# EAGLE design Connector Board rev1 (EAGLE 9.6.2)

## Sheet 1 of 3
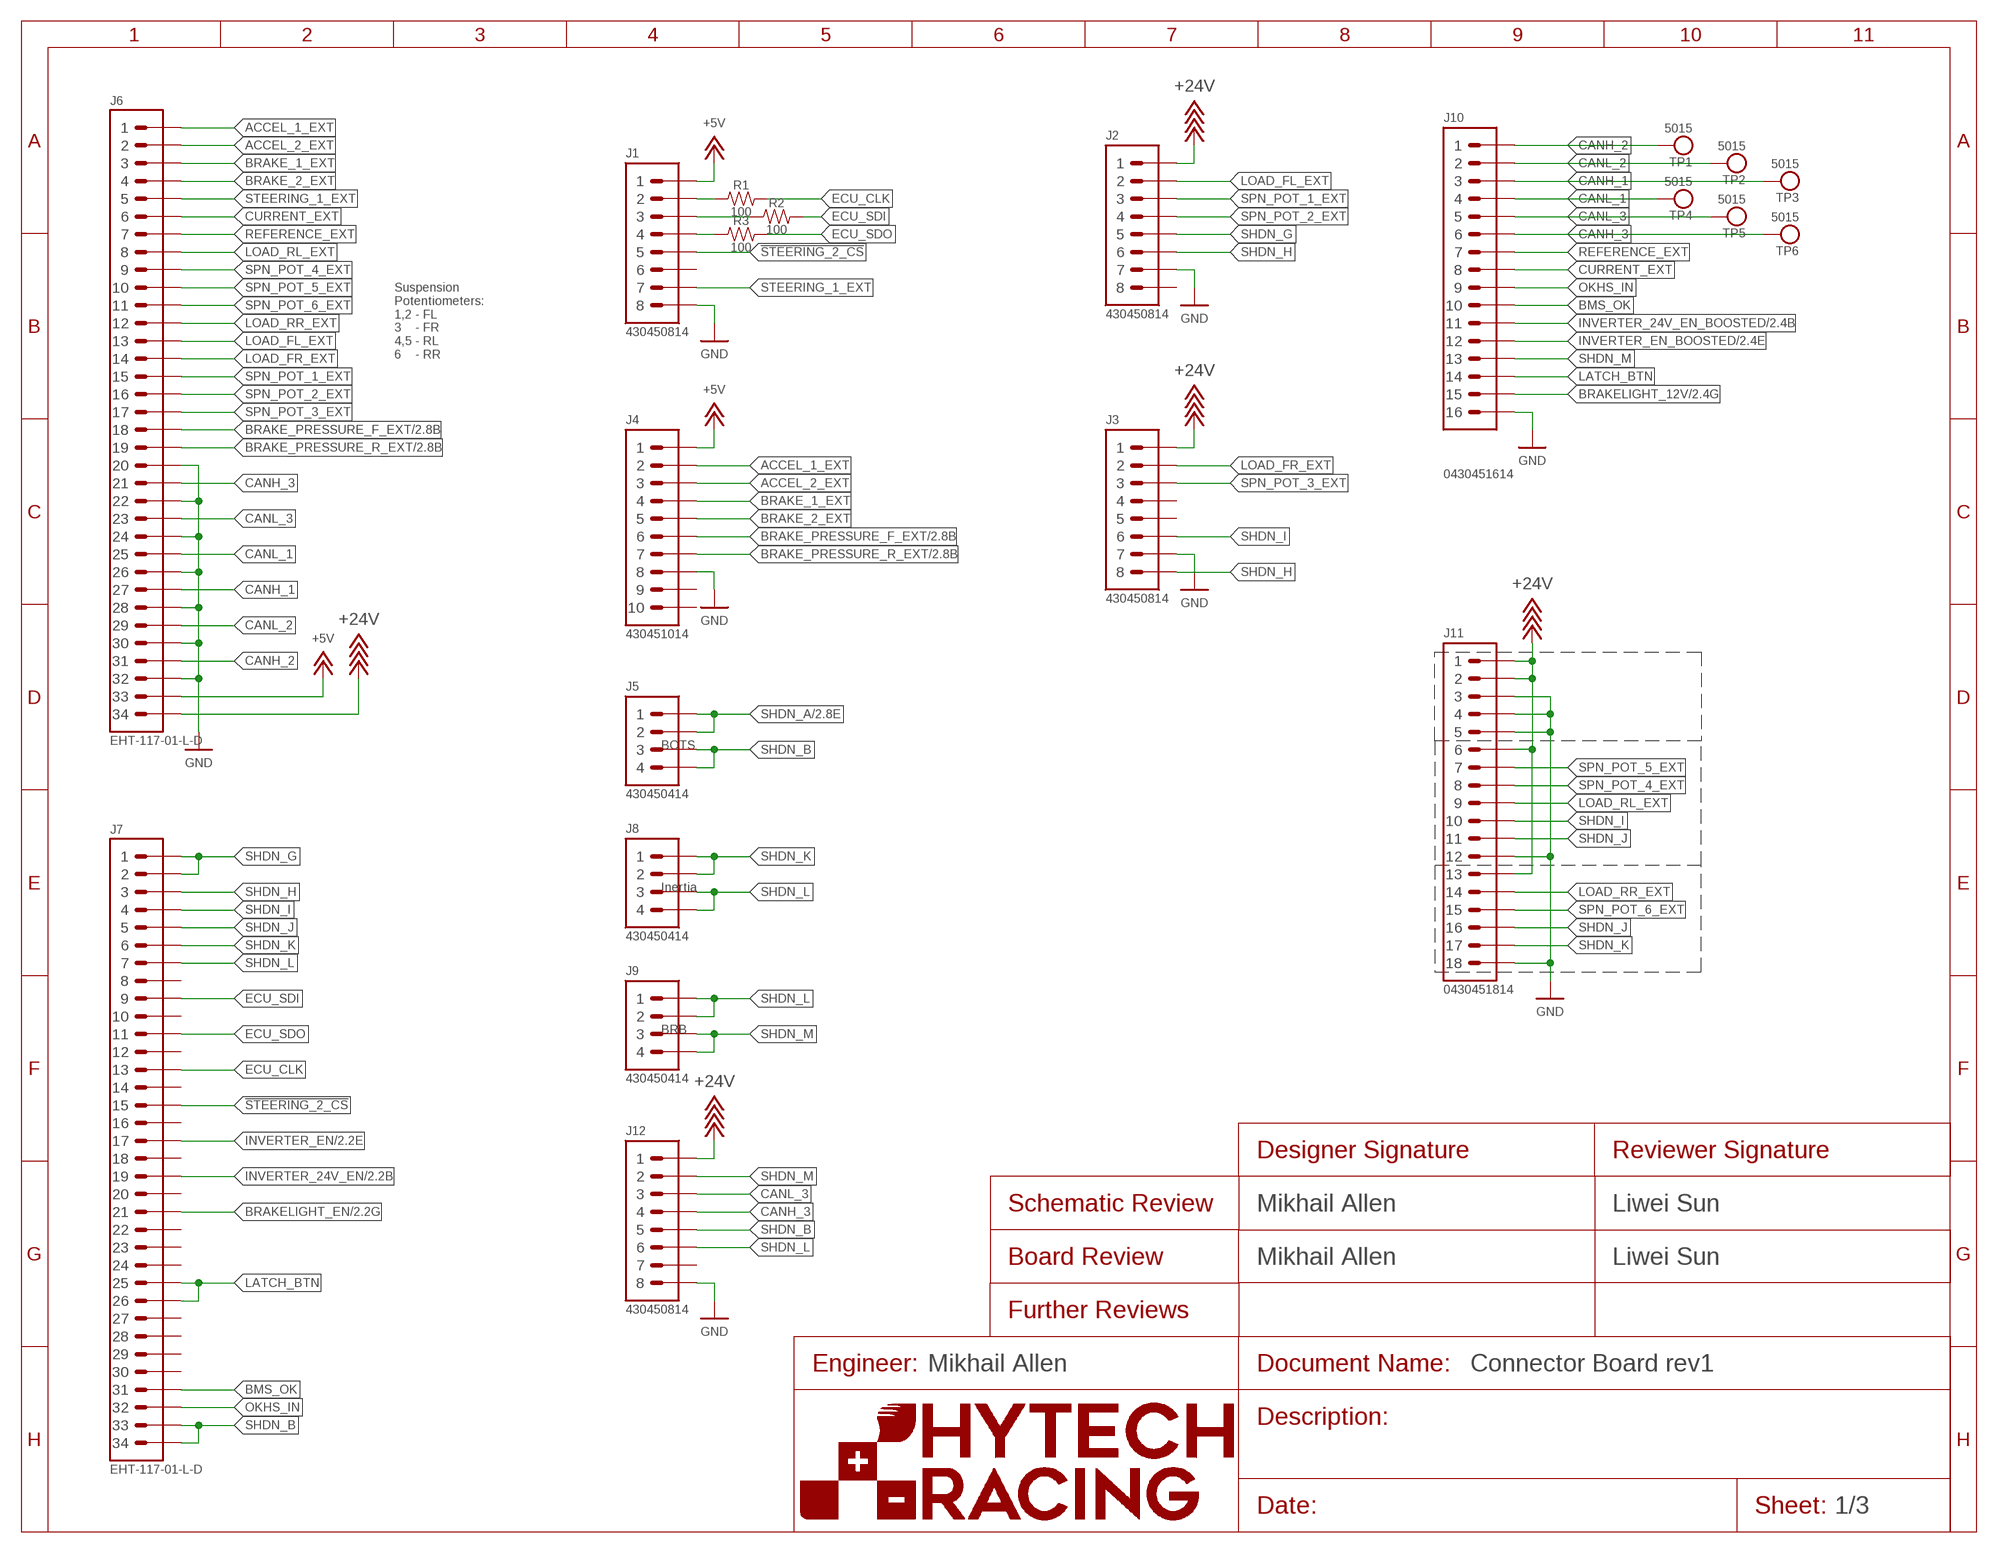
[diagram p0: schematic, sheet 1]
FRAME1 (FRAME): DESIGNER_BOARD: Mikhail Allen; DESIGNER_SCHEMATIC: Mikhail Allen; ENGINEER: Mikhail Allen; REVIEWER_BOARD: Liwei Sun; REVIEWER_SCHEMATIC: Liwei Sun

### Parts
J1  CONNECTOR-8_μF_T_V_BLACK  [MOLEX_MICROFIT_PTH_VERTICAL_08_DUAL]
J2  CONNECTOR-8_μF_T_V_BLACK  [MOLEX_MICROFIT_PTH_VERTICAL_08_DUAL]
J3  CONNECTOR-8_μF_T_V_BLACK  [MOLEX_MICROFIT_PTH_VERTICAL_08_DUAL]
J4  CONNECTOR-10_MF_T_V_  [MOLEX_MICROFIT_PTH_VERTICAL_10_DUAL]
J5  CONNECTOR-4_μF_T_V_BLACK  [MOLEX_MICROFIT_PTH_VERTICAL_04_DUAL]
J6  CONNECTOR-34__  [EHT-117-01]
J7  CONNECTOR-34__  [EHT-117-01]
J8  CONNECTOR-4_μF_T_V_BLACK  [MOLEX_MICROFIT_PTH_VERTICAL_04_DUAL]
J9  CONNECTOR-4_μF_T_V_BLACK  [MOLEX_MICROFIT_PTH_VERTICAL_04_DUAL]
J10  CONNECTOR-16_MF_T_V_  [MOLEX_MICROFIT_PTH_VERTICAL_16_DUAL]
J11  CONNECTOR-18_MF_T_V_  [MOLEX_MICROFIT_PTH_VERTICAL_18_DUAL]
J12  CONNECTOR-8_μF_T_V_BLACK  [MOLEX_MICROFIT_PTH_VERTICAL_08_DUAL]
R1  RESISTOR_0603_100  [0603-RES]
R2  RESISTOR_0603_100  [0603-RES]
R3  RESISTOR_0603_100  [0603-RES]
TP1  TEST_POINT  [5015]
TP2  TEST_POINT  [5015]
TP3  TEST_POINT  [5015]
TP4  TEST_POINT  [5015]
TP5  TEST_POINT  [5015]
TP6  TEST_POINT  [5015]

### Nets
!STEERING_2_CS: J1.5 J7.15
+5V: J1.1 J4.1 J6.33
+24V: J2.1 J3.1 J6.34 J11.1 J11.2 J11.6 J11.13 J12.1 ; also sheet 2
ACCEL_1_EXT: J4.2 J6.1
ACCEL_2_EXT: J4.3 J6.2
BMS_OK: J7.31 J10.10
BRAKE_1_EXT: J4.4 J6.3
BRAKE_2_EXT: J4.5 J6.4
BRAKE_PRESSURE_F_EXT: J4.6 J6.18 ; also sheet 2
BRAKE_PRESSURE_R_EXT: J4.7 J6.19 ; also sheet 2
BRAKELIGHT_12V: J10.15 ; also sheet 2
BRAKELIGHT_EN: J7.21 ; also sheet 2
CANH_1: J6.27 J10.3 TP3.1
CANH_2: J6.31 J10.1 TP1.1
CANH_3: J6.21 J10.6 J12.4 TP6.1
CANL_1: J6.25 J10.4 TP4.1
CANL_2: J6.29 J10.2 TP2.1
CANL_3: J6.23 J10.5 J12.3 TP5.1
CURRENT_EXT: J6.6 J10.8
ECU_CLK: J7.13 R1.2
ECU_SDI: J7.9 R2.2
ECU_SDO: J7.11 R3.2
GND: J1.8 J2.7 J3.7 J4.8 J6.20 J6.22 J6.24 J6.26 J6.28 J6.30 J6.32 J10.16 J11.3 J11.4 J11.5 J11.12 J11.18 J12.8 ; also sheet 2
INVERTER_24V_EN: J7.19 ; also sheet 2
INVERTER_24V_EN_BOOSTED: J10.11 ; also sheet 2
INVERTER_EN: J7.17 ; also sheet 2
INVERTER_EN_BOOSTED: J10.12 ; also sheet 2
LATCH_BTN: J7.25 J7.26 J10.14
LOAD_FL_EXT: J2.2 J6.13
LOAD_FR_EXT: J3.2 J6.14
LOAD_RL_EXT: J6.8 J11.9
LOAD_RR_EXT: J6.12 J11.14
N$1: J1.2 R1.1
N$2: J1.3 R2.1
N$3: J1.4 R3.1
OKHS_IN: J7.32 J10.9
REFERENCE_EXT: J6.7 J10.7
SHDN_A: J5.1 J5.2 ; also sheet 2
SHDN_B: J5.3 J5.4 J7.33 J7.34 J12.5
SHDN_G: J2.5 J7.1 J7.2
SHDN_H: J2.6 J3.8 J7.3
SHDN_I: J3.6 J7.4 J11.10
SHDN_J: J7.5 J11.11 J11.16
SHDN_K: J7.6 J8.1 J8.2 J11.17
SHDN_L: J7.7 J8.3 J8.4 J9.1 J9.2 J12.6
SHDN_M: J9.3 J9.4 J10.13 J12.2
SPN_POT_1_EXT: J2.3 J6.15
SPN_POT_2_EXT: J2.4 J6.16
SPN_POT_3_EXT: J3.3 J6.17
SPN_POT_4_EXT: J6.9 J11.8
SPN_POT_5_EXT: J6.10 J11.7
SPN_POT_6_EXT: J6.11 J11.15
STEERING_1_EXT: J1.7 J6.5
Unconnected: J1.6 J2.8 J3.4 J3.5 J4.9 J4.10 J7.8 J7.10 J7.12 J7.14 J7.16 J7.18 J7.20 J7.22 J7.23 J7.24 J7.27 J7.28 J7.29 J7.30 J12.7

### Notes on the sheet
- Suspension
  Potentiometers:
  1,2 - FL
  3    - FR
  4,5 - RL
  6    - RR
- BOTS
- Inertia
- BRB

## Sheet 2 of 3
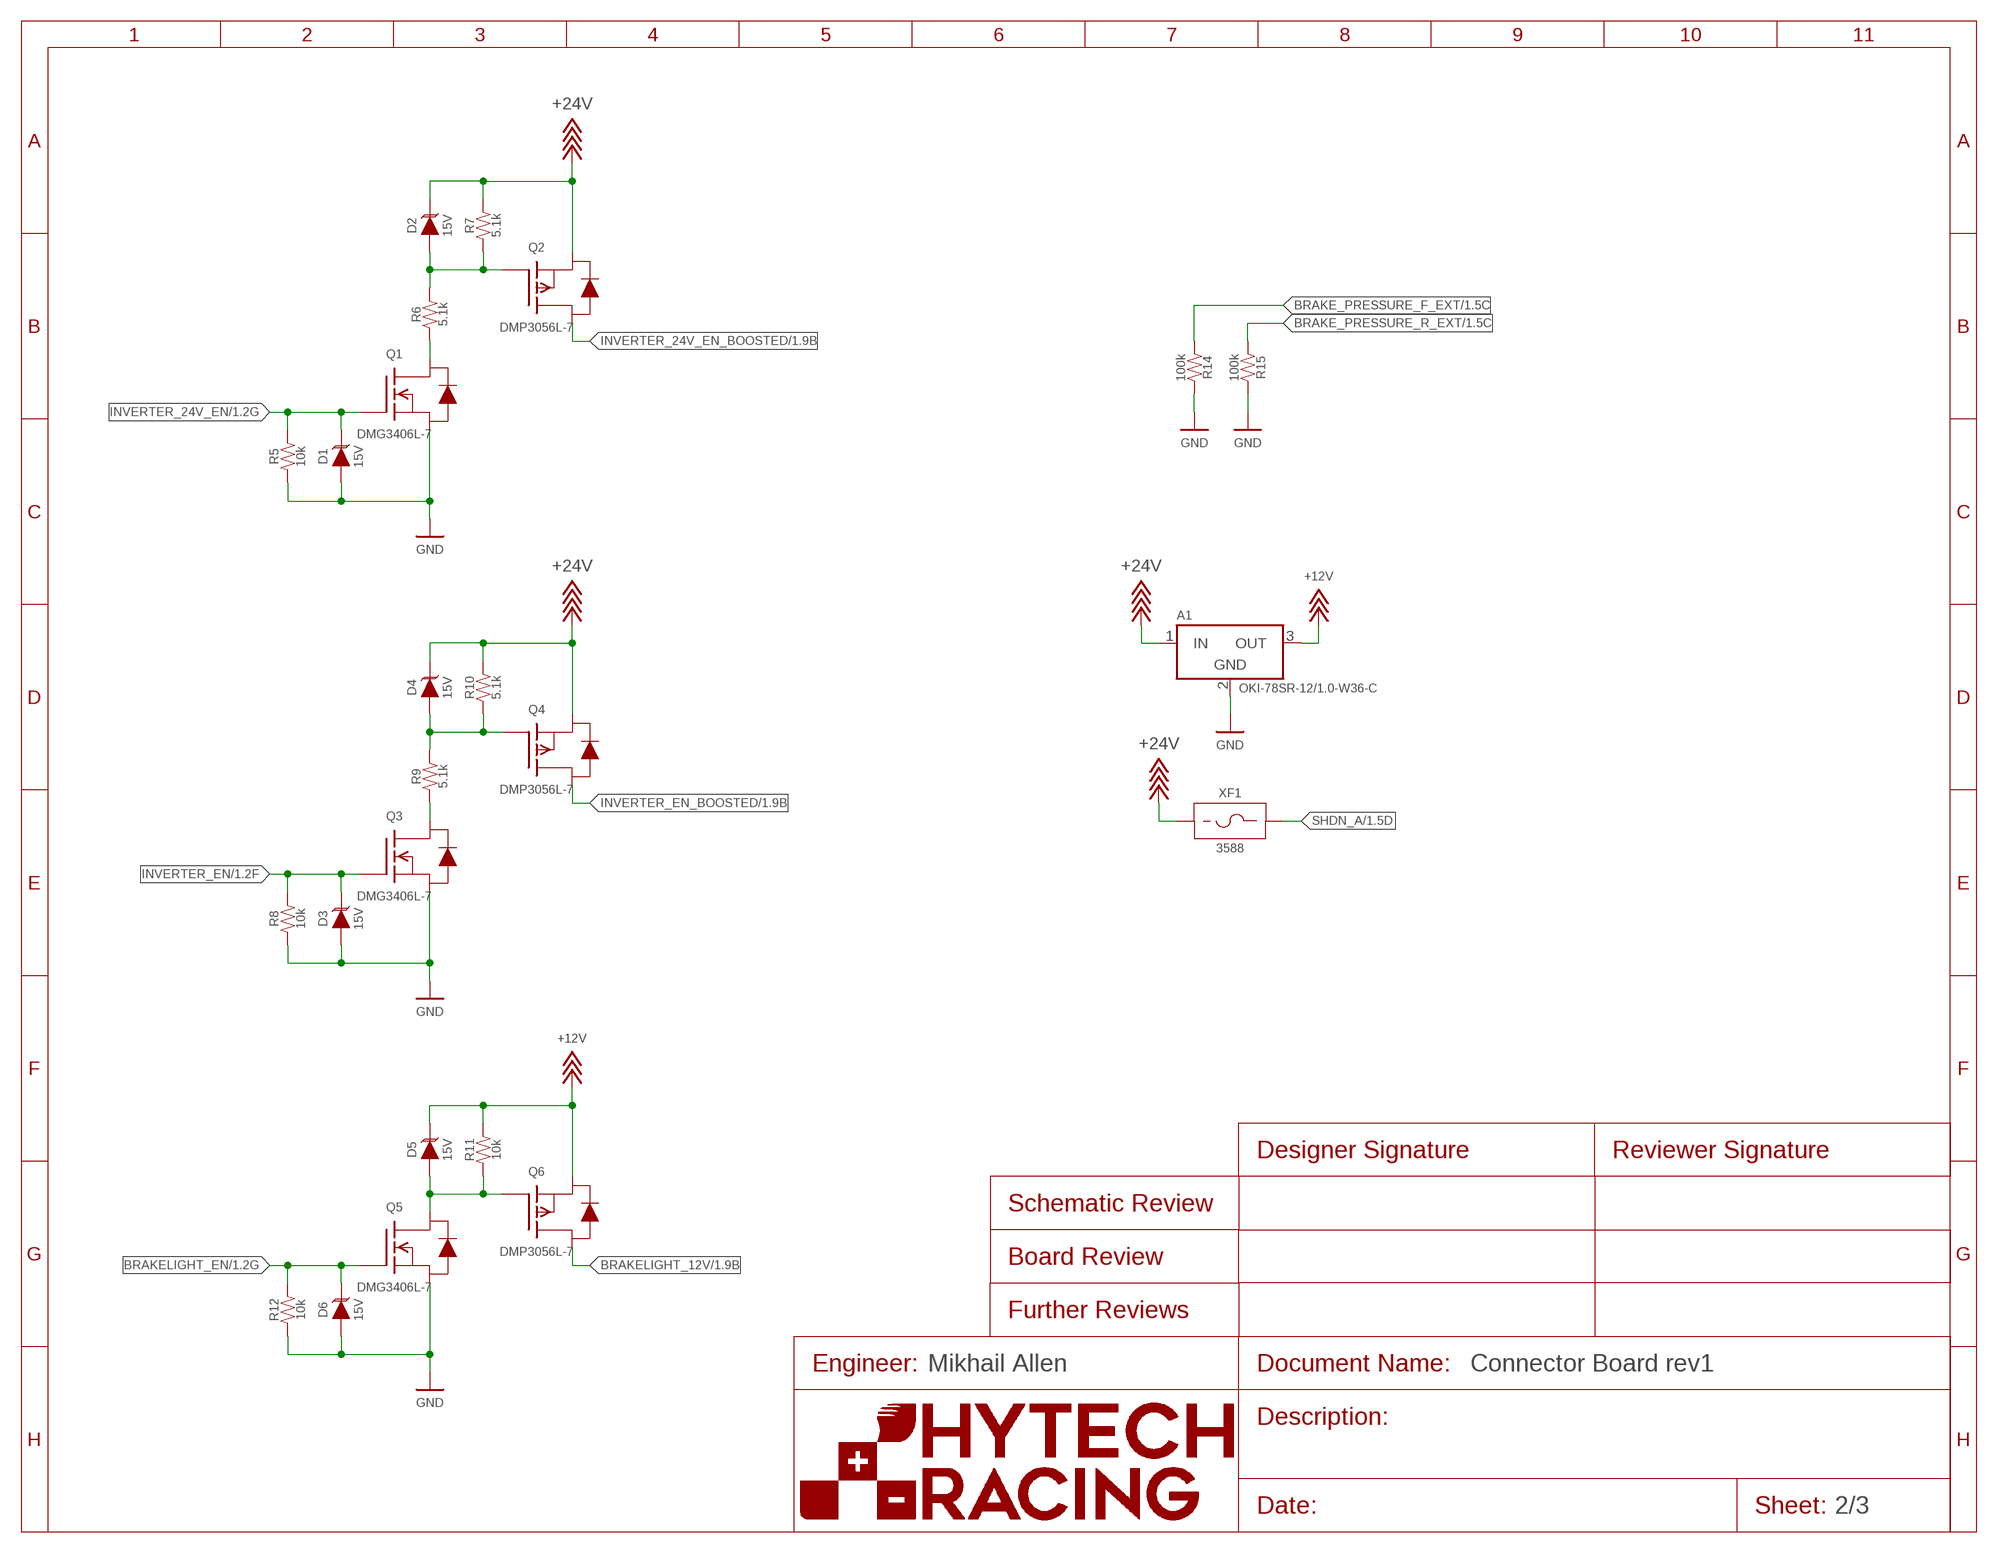
[diagram p1: schematic, sheet 2]
FRAME2 (FRAME): ENGINEER: Mikhail Allen

### Parts
A1  VOLTAGE_REGULATOR_MODULE_OKI-78SR_12V  [OKI-78SR]
D1  TVS__15V  [SOT-23]
D2  TVS__15V  [SOT-23]
D3  TVS__15V  [SOT-23]
D4  TVS__15V  [SOT-23]
D5  TVS__15V  [SOT-23]
D6  TVS__15V  [SOT-23]
Q1  TRANSISTOR_N_MOS__DMG3406L-7  [SOT-23]
Q2  TRANSISTOR_P_MOS_SOT-23_DMP3056L-7  [SOT-23]
Q3  TRANSISTOR_N_MOS__DMG3406L-7  [SOT-23]
Q4  TRANSISTOR_P_MOS_SOT-23_DMP3056L-7  [SOT-23]
Q5  TRANSISTOR_N_MOS__DMG3406L-7  [SOT-23]
Q6  TRANSISTOR_P_MOS_SOT-23_DMP3056L-7  [SOT-23]
R5  RESISTOR_0603_10K  [0603-RES]
R6  RESISTOR_0603_5.1K  [0603-RES]
R7  RESISTOR_0603_5.1K  [0603-RES]
R8  RESISTOR_0603_10K  [0603-RES]
R9  RESISTOR_0603_5.1K  [0603-RES]
R10  RESISTOR_0603_5.1K  [0603-RES]
R11  RESISTOR_0603_10K  [0603-RES]
R12  RESISTOR_0603_10K  [0603-RES]
R14  RESISTOR_0603_100K  [0603-RES]
R15  RESISTOR_0603_100K  [0603-RES]
XF1  FUSE_HOLDER_MINIBLADESMD  [3588]

### Nets
+12V: A1.3(OUT) D5.3(C) Q6.2(S) R11.2
+24V: A1.1(IN) D2.3(C) D4.3(C) Q2.2(S) Q4.2(S) R7.2 R10.2 XF1.1 XF1.2 ; also sheet 1
BRAKE_PRESSURE_F_EXT: R14.1 ; also sheet 1
BRAKE_PRESSURE_R_EXT: R15.1 ; also sheet 1
BRAKELIGHT_12V: Q6.3(D) ; also sheet 1
BRAKELIGHT_EN: D6.3(C) Q5.1(G) R12.2 ; also sheet 1
GND: A1.2(GND) D1.1(A) D3.1(A) D6.1(A) Q1.2(S) Q3.2(S) Q5.2(S) R5.1 R8.1 R12.1 R14.2 R15.2 ; also sheet 1
INVERTER_24V_EN: D1.3(C) Q1.1(G) R5.2 ; also sheet 1
INVERTER_24V_EN_BOOSTED: Q2.3(D) ; also sheet 1
INVERTER_EN: D3.3(C) Q3.1(G) R8.2 ; also sheet 1
INVERTER_EN_BOOSTED: Q4.3(D) ; also sheet 1
N$5: D2.1(A) Q2.1(G) R6.2 R7.1
N$7: Q1.3(D) R6.1
N$8: D4.1(A) Q4.1(G) R9.2 R10.1
N$9: Q3.3(D) R9.1
N$11: D5.1(A) Q5.3(D) Q6.1(G) R11.1
SHDN_A: XF1.3 XF1.4 ; also sheet 1

## Sheet 3 of 3
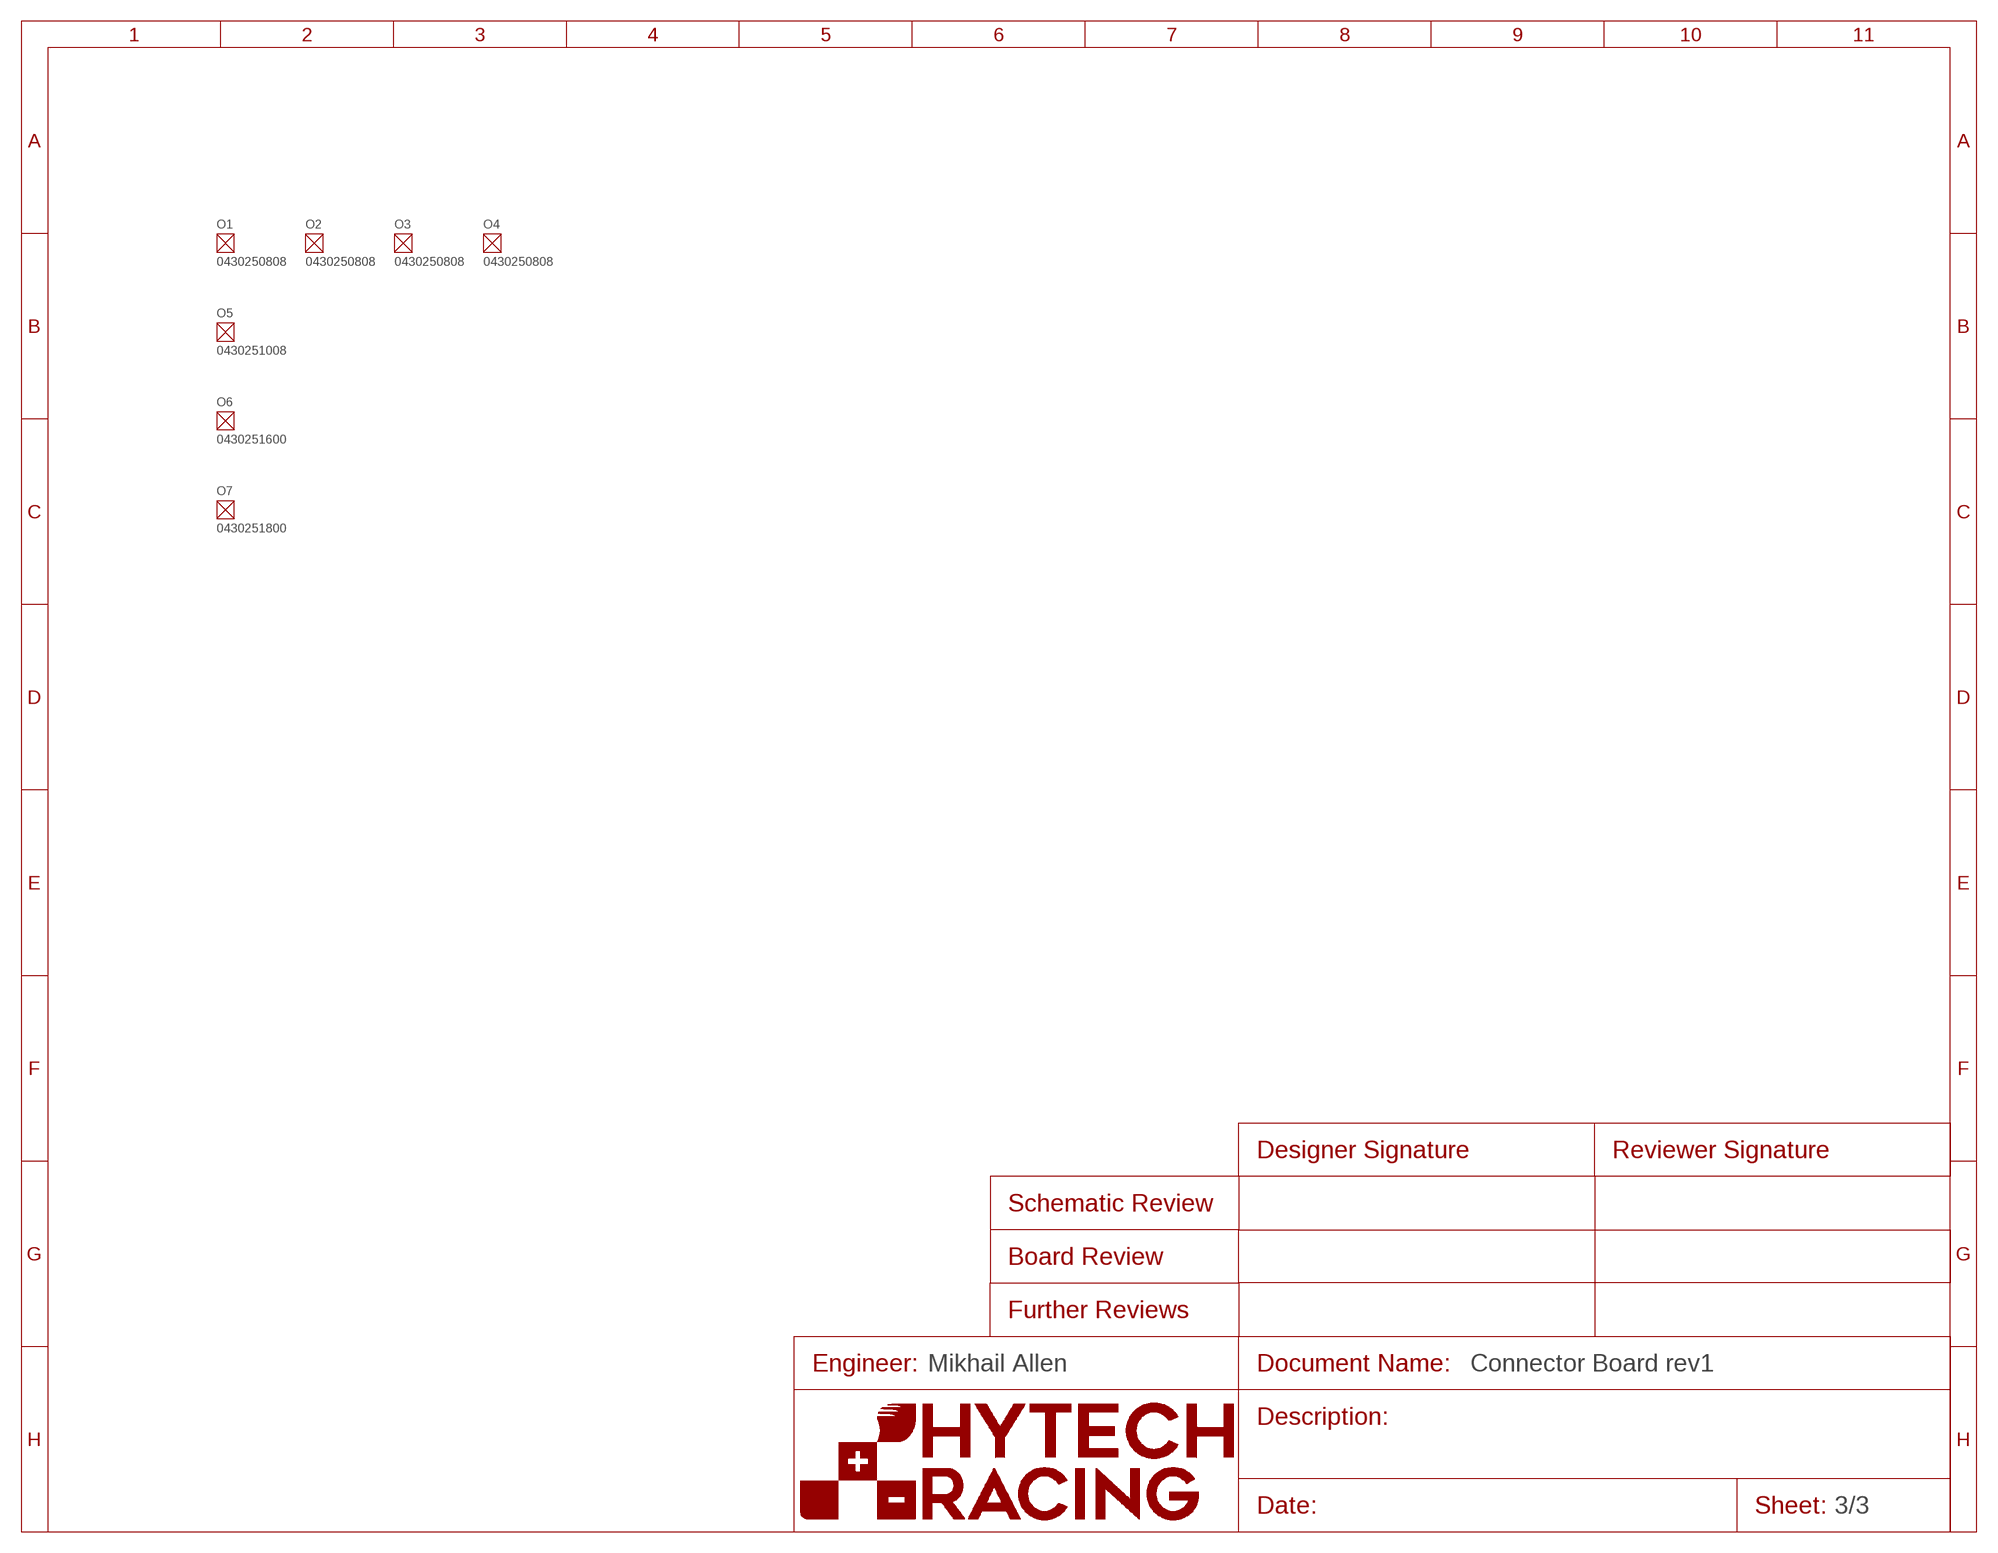
[diagram p2: schematic, sheet 3]
FRAME3 (FRAME): ENGINEER: Mikhail Allen
O1 (RECEPTACLE-8_MICROFIT): DKPN: WM13210-ND; MANUFACTURER: Molex; MOPN: 538-43025-0808; MPN: 0430250808
O2 (RECEPTACLE-8_MICROFIT): DKPN: WM13210-ND; MANUFACTURER: Molex; MOPN: 538-43025-0808; MPN: 0430250808
O3 (RECEPTACLE-8_MICROFIT): DKPN: WM13210-ND; MANUFACTURER: Molex; MOPN: 538-43025-0808; MPN: 0430250808
O4 (RECEPTACLE-8_MICROFIT): DKPN: WM13210-ND; MANUFACTURER: Molex; MOPN: 538-43025-0808; MPN: 0430250808
O5 (RECEPTACLE-10_MICROFIT): DKPN: WM16255-ND; MANUFACTURER: Molex; MOPN: 538-43025-1008; MPN: 0430251008
O6 (RECEPTACLE-16_MICROFIT): DKPN: WM2490-ND; MANUFACTURER: Molex; MOPN: 538-43025-1600; MPN: 0430251600
O7 (RECEPTACLE-18_MICROFIT): DKPN: WM2491-ND; MANUFACTURER: Molex; MOPN: 538-43025-1800; MPN: 0430251800

## Library data of the parts
A1 = HyTechDevices:VOLTAGE_REGULATOR_MODULE_?_*: Voltage Regulator Modules OKI-78SR Datasheet <https://www.mouser.com/datasheet/2/281/oki-78sr-56393.pdf>; DKPN: 811-3293-ND; MANUFACTURER: Murata Power Solutions Inc.; MOPN: 580-OKI78SR12/1W36C; MPN: OKI-78SR-12/1.0-W36-C
D1-D6 = HyTechDevices:TVS_?_*: TVS Diode GSOT Datasheet <https://www.mouser.com/datasheet/2/427/gsot03-1767593.pdf>; DKPN: GSOT15-E3-08CT-ND; MANUFACTURER: Vishay General Semiconductor - Diodes Division; MOPN: 78-GSOT15-E3-08; MPN: GSOT15-E3-08; VOLTAGE: 15V
J1-J3 J12 = HyTechDevices:CONNECTOR-8_?_*: 8 Pin Connector; DKPN: WM1798-ND; MANUFACTURER: Molex; MOPN: 538-43045-0814; MPN: 430450814
J4 = HyTechDevices:CONNECTOR-10_?_*: 10 pin connector Datasheet <https://www.mouser.com/datasheet/2/276/0430451014_PCB_HEADERS-143158.pdf>; DKPN: WM1799-ND; MANUFACTURER: MOLEX; MOPN: 538-43045-1014; MPN: 430451014
J5 J8 J9 = HyTechDevices:CONNECTOR-4_?_*: 4 Pin Connector; DKPN: 2266-43045-0414-ND; MANUFACTURER: Molex; MOPN: 538-43045-0414; MPN: 430450414
J6 J7 = HyTechDevices:CONNECTOR-34_?_*: 34 pin ribbon connector header (EHT-117-01) Catalog <https://suddendocs.samtec.com/catalog_english/eht.pdf> Datasheet <http://suddendocs.samtec.com/prints/eht-d.pdf> Part <https://www.digikey.com/en/products/detail/samtec-inc/EHT-117-01-L-D/6694623>; DKPN: SAM15557-ND; MANUFACTURER: Samtec; MOPN: 200-EHT11701LD; MPN: EHT-117-01-L-D
J10 = HyTechDevices:CONNECTOR-16_?_*: 16 pin connector Datasheet <https://www.molex.com/webdocs/datasheets/pdf/en-us/2068321602_PCB_HEADERS.pdf>; DKPN: WM4718-ND; MANUFACTURER: MOLEX; MOPN: 538-43045-1614; MPN: 0430451614
J11 = HyTechDevices:CONNECTOR-18_?_*: 18 pin connector Datasheet <https://www.molex.com/webdocs/datasheets/pdf/en-us/2068321802_PCB_HEADERS.pdf>; DKPN: WM4719-ND; MANUFACTURER: MOLEX; MOPN: 538-43045-1814; MPN: 0430451814
Q1 Q3 Q5 = HyTechDevices:TRANSISTOR_N_MOS_?_*: N-MOSFET PMV15ENEA Datasheet <https://www.mouser.com/datasheet/2/916/PMV15ENEA-1604828.pdf> TK6P65W Datasheet <https://www.mouser.com/datasheet/2/408/TK6P65W_datasheet_en_20151225-1916290.pdf> SIR638ADP Datasheet <https://www.mouser.com/datasheet/2/427/sir638adp-1766131.pdf> DMG3406L Datasheet <https://www.diodes.com/assets/Datasheets/DMG3406L.pdf> STL2N80K5 <https://www.mouser.com/datasheet/2/389/dm00092662-1798082.pdf>; DKPN: DMG3406L-7DITR-ND; MANUFACTURER: Diodes Incorporated; MOPN: 621-DMG3406L-7; MPN: DMG3406L-7
Q2 Q4 Q6 = HyTechDevices:TRANSISTOR_P_MOS_?_*: P-MOSFET SI2369DS Datasheet <https://www.mouser.com/datasheet/2/427/si2369d-1764360.pdf> DMP3056L Datasheet <https://www.mouser.com/datasheet/2/115/DIOD_S_A0012915142_1-2543925.pdf>; DKPN: DMP3056L-7DITR-ND; MANUFACTURER: Diodes Incorporated; MOPN: 621-DMP3056L-7; MPN: DMP3056L-7
R1-R3 = HyTechDevices:RESISTOR_?_*: Resistor PWR163 Series <https://www.mouser.com/datasheet/2/54/pwr163-777985.pdf> AC Series <https://www.mouser.com/datasheet/2/447/Yageo_PYu_AC_51_RoHS_L_7_1714230-1874691.pdf> PU Series <https://www.mouser.com/datasheet/2/447/PYu-PU_51_RoHS_L_6-1504619.pdf> ERA Series <https://www.mouser.com/datasheet/2/315/AOA0000C307-1149632.pdf> PWR263 Series <https://www.mouser.com/datasheet/2/54/pwr263s_35-778069.pdf> KTR Series <https://www.mouser.com/datasheet/2/348/ROHM_S_A0011075115_1-2563276.pdf> RC Series <https://www.mouser.com/datasheet/2/447/Yageo_03_18_2021_PYu_RC_Group_51_RoHS_L_11-2199992.pdf> ERJ PB3, PB6 Series <https://www.mouser.com/datasheet/2/315/AOA0000C328-1530132.pdf> ERJ PA2, P03, PA3, P06, P08, P14 Series <https://www.mouser.com/datasheet/2/315/AOA0000C331-1141874.pdf> B20 Series <https://www.ohmite.com/assets/docs/res_200.pdf?r=false> TE Connectivity/Holsworthy RN73 Series <https://www.mouser.com/datasheet/2/418/4/NG_DS_1773270_M-604713.pdf> Vishay Dale D/CRCW e3 <https://www.mouser.com/datasheet/2/427/dcrcwe3-1762152.pdf> Ohmite B20 <https://www.ohmite.com/assets/docs/res_200.pdf?r=false>; DKPN: 311-100HRCT-ND; MANUFACTURER: Yageo; MOPN: 603-RC0603FR-07100RL; MPN: RC0603FR-07100RL; POWER: 0.1W; RESISTANCE: 100; TOLERANCE: 1%; VOLTAGE_CONTINUOUS: 3.16V; VOLTAGE_MAX: 75V
R5 R8 R11 R12 = HyTechDevices:RESISTOR_?_*: Resistor PWR163 Series <https://www.mouser.com/datasheet/2/54/pwr163-777985.pdf> AC Series <https://www.mouser.com/datasheet/2/447/Yageo_PYu_AC_51_RoHS_L_7_1714230-1874691.pdf> PU Series <https://www.mouser.com/datasheet/2/447/PYu-PU_51_RoHS_L_6-1504619.pdf> ERA Series <https://www.mouser.com/datasheet/2/315/AOA0000C307-1149632.pdf> PWR263 Series <https://www.mouser.com/datasheet/2/54/pwr263s_35-778069.pdf> KTR Series <https://www.mouser.com/datasheet/2/348/ROHM_S_A0011075115_1-2563276.pdf> RC Series <https://www.mouser.com/datasheet/2/447/Yageo_03_18_2021_PYu_RC_Group_51_RoHS_L_11-2199992.pdf> ERJ PB3, PB6 Series <https://www.mouser.com/datasheet/2/315/AOA0000C328-1530132.pdf> ERJ PA2, P03, PA3, P06, P08, P14 Series <https://www.mouser.com/datasheet/2/315/AOA0000C331-1141874.pdf> B20 Series <https://www.ohmite.com/assets/docs/res_200.pdf?r=false> TE Connectivity/Holsworthy RN73 Series <https://www.mouser.com/datasheet/2/418/4/NG_DS_1773270_M-604713.pdf> Vishay Dale D/CRCW e3 <https://www.mouser.com/datasheet/2/427/dcrcwe3-1762152.pdf> Ohmite B20 <https://www.ohmite.com/assets/docs/res_200.pdf?r=false>; DKPN: P10KBDCT-ND; MANUFACTURER: Panasonic Electronic Components; MOPN: 667-ERA-3ARB103V; MPN: ERA-3ARB103V; POWER: 0.1W; RESISTANCE: 10k; TOLERANCE: 0.1%; VOLTAGE_CONTINUOUS: 31.62V; VOLTAGE_MAX: 75V
R6 R7 R9 R10 = HyTechDevices:RESISTOR_?_*: Resistor PWR163 Series <https://www.mouser.com/datasheet/2/54/pwr163-777985.pdf> AC Series <https://www.mouser.com/datasheet/2/447/Yageo_PYu_AC_51_RoHS_L_7_1714230-1874691.pdf> PU Series <https://www.mouser.com/datasheet/2/447/PYu-PU_51_RoHS_L_6-1504619.pdf> ERA Series <https://www.mouser.com/datasheet/2/315/AOA0000C307-1149632.pdf> PWR263 Series <https://www.mouser.com/datasheet/2/54/pwr263s_35-778069.pdf> KTR Series <https://www.mouser.com/datasheet/2/348/ROHM_S_A0011075115_1-2563276.pdf> RC Series <https://www.mouser.com/datasheet/2/447/Yageo_03_18_2021_PYu_RC_Group_51_RoHS_L_11-2199992.pdf> ERJ PB3, PB6 Series <https://www.mouser.com/datasheet/2/315/AOA0000C328-1530132.pdf> ERJ PA2, P03, PA3, P06, P08, P14 Series <https://www.mouser.com/datasheet/2/315/AOA0000C331-1141874.pdf> B20 Series <https://www.ohmite.com/assets/docs/res_200.pdf?r=false> TE Connectivity/Holsworthy RN73 Series <https://www.mouser.com/datasheet/2/418/4/NG_DS_1773270_M-604713.pdf> Vishay Dale D/CRCW e3 <https://www.mouser.com/datasheet/2/427/dcrcwe3-1762152.pdf> Ohmite B20 <https://www.ohmite.com/assets/docs/res_200.pdf?r=false>; DKPN: 311-5.10KHRTR-ND; MANUFACTURER: Yageo; MOPN: 603-RC0603FR-075K1L; MPN: RC0603FR-075K1L; POWER: 0.1W; RESISTANCE: 5.1k; TOLERANCE: 1%; VOLTAGE_CONTINUOUS: 22.58V; VOLTAGE_MAX: 75V
R14 R15 = HyTechDevices:RESISTOR_?_*: Resistor PWR163 Series <https://www.mouser.com/datasheet/2/54/pwr163-777985.pdf> AC Series <https://www.mouser.com/datasheet/2/447/Yageo_PYu_AC_51_RoHS_L_7_1714230-1874691.pdf> PU Series <https://www.mouser.com/datasheet/2/447/PYu-PU_51_RoHS_L_6-1504619.pdf> ERA Series <https://www.mouser.com/datasheet/2/315/AOA0000C307-1149632.pdf> PWR263 Series <https://www.mouser.com/datasheet/2/54/pwr263s_35-778069.pdf> KTR Series <https://www.mouser.com/datasheet/2/348/ROHM_S_A0011075115_1-2563276.pdf> RC Series <https://www.mouser.com/datasheet/2/447/Yageo_03_18_2021_PYu_RC_Group_51_RoHS_L_11-2199992.pdf> ERJ PB3, PB6 Series <https://www.mouser.com/datasheet/2/315/AOA0000C328-1530132.pdf> ERJ PA2, P03, PA3, P06, P08, P14 Series <https://www.mouser.com/datasheet/2/315/AOA0000C331-1141874.pdf> B20 Series <https://www.ohmite.com/assets/docs/res_200.pdf?r=false> TE Connectivity/Holsworthy RN73 Series <https://www.mouser.com/datasheet/2/418/4/NG_DS_1773270_M-604713.pdf> Vishay Dale D/CRCW e3 <https://www.mouser.com/datasheet/2/427/dcrcwe3-1762152.pdf> Ohmite B20 <https://www.ohmite.com/assets/docs/res_200.pdf?r=false>; DKPN: 311-100KHRTR-ND; MANUFACTURER: Yageo; MOPN: 603-RC0603FR-07100KL; MPN: RC0603FR-07100KL; POWER: 0.1W; RESISTANCE: 100k; TOLERANCE: 1%; VOLTAGE_CONTINUOUS: 75V; VOLTAGE_MAX: 75V
TP1-TP6 = HyTechDevices:TEST_POINT: Test Point for Probing; DKPN: 36-5015CT-ND; MANUFACTURER: Keystone Electronics; MOPN: 534-5015; MPN: 5015
XF1 = HyTechDevices:FUSE_HOLDER_*: Fuse Holder All PNs for the holder; if Miniblade Fuses <https://www.littelfuse.com/media?resourcetype=datasheets&itemid=0f5f58cb-559e-494b-8d53-723f30445ae5&filename=littelfuse-mini-datasheet> needed, order separately. Mini-Blade PTH <https://www.mouser.com/datasheet/2/215/3568-742601.pdf> Mini-Blade SMD <https://www.mouser.com/datasheet/2/215/588-744913.pdf> Littelfuse 122 Fuse Holder and Fuse Fuse <https://www.littelfuse.com/~/media/electronics/datasheets/fuses/littelfuse_fuse_508_datasheet.pdf.pdf> Fuse Holder <https://www.littelfuse.com/~/media/electronics/datasheets/fuse_clips/littelfuse_fuse_clip_102_122_datasheet.pdf.pdf>; DKPN: 36-3588-ND; FUSE_TYPE: MINI 297; MANUFACTURER: Keystone Electronics; MOPN: 534-3588; MPN: 3588

## Board
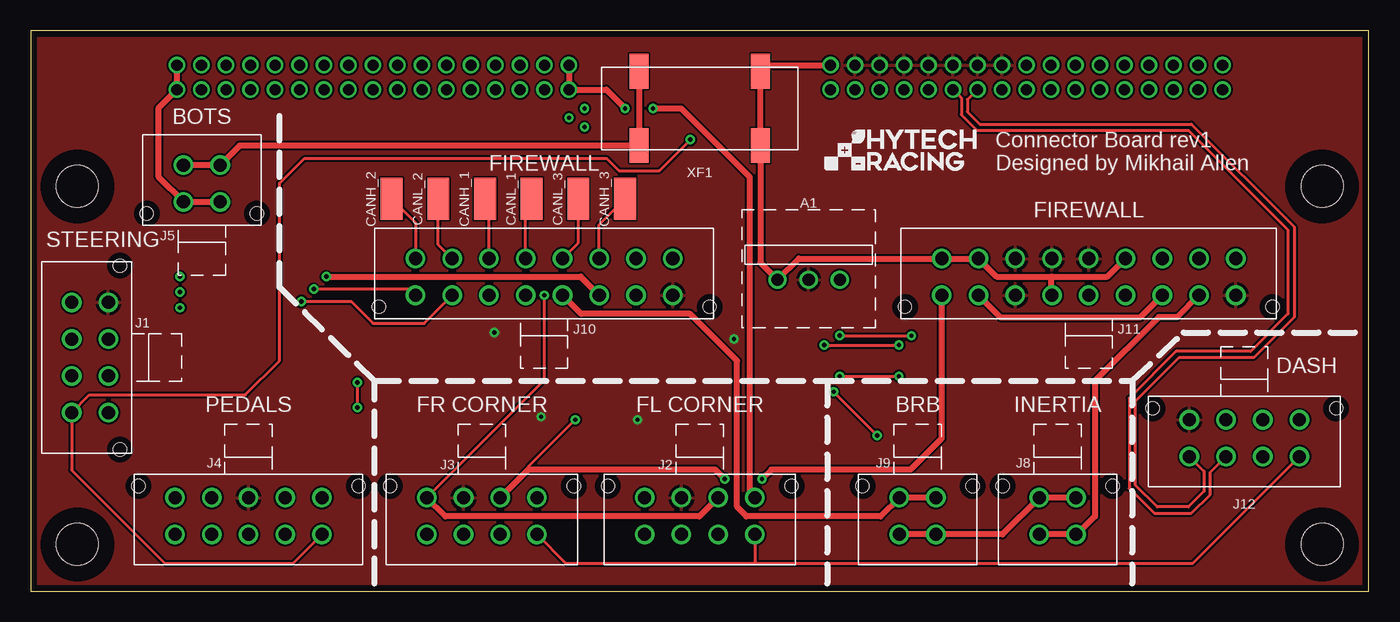
[diagram p3: board, top side]
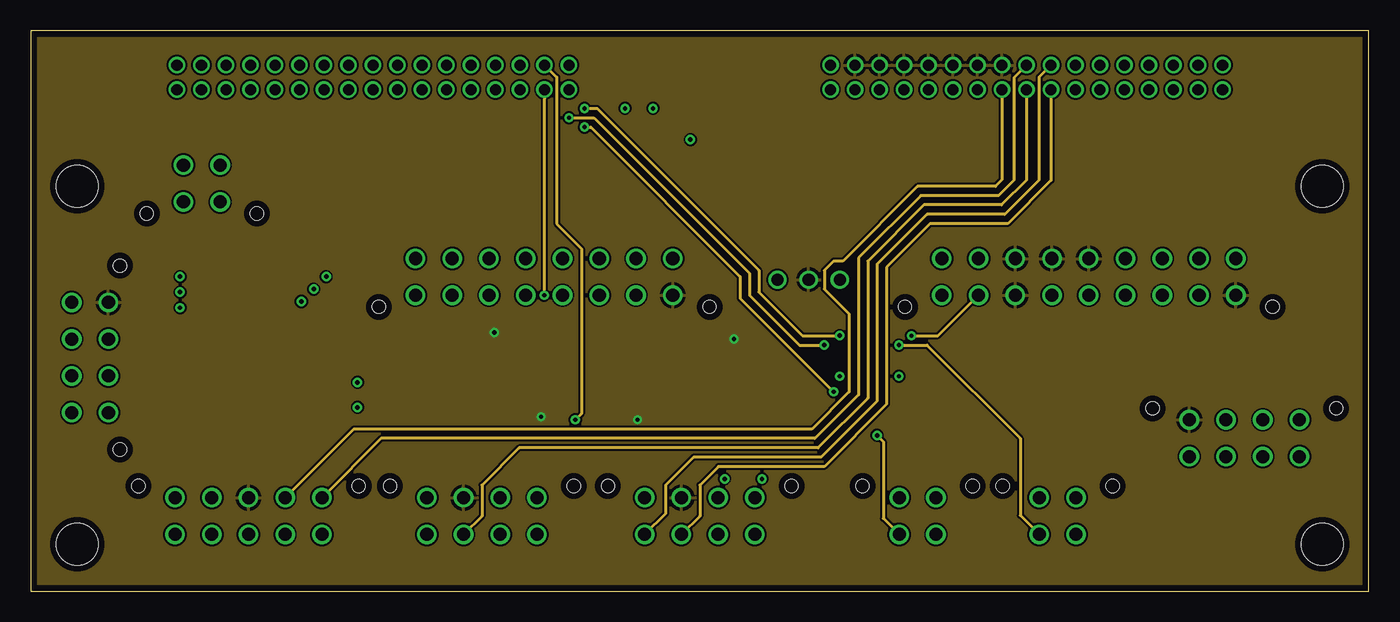
[diagram p4: board, inner layer Route2]
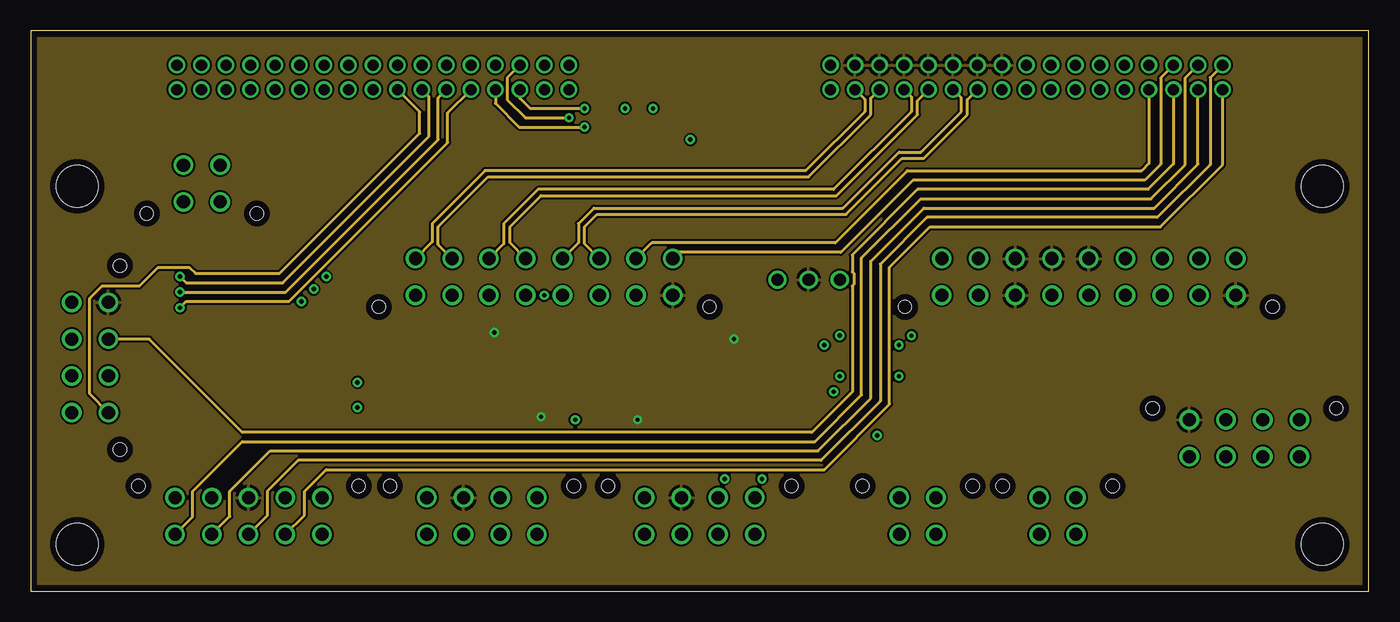
[diagram p5: board, inner layer Route15]
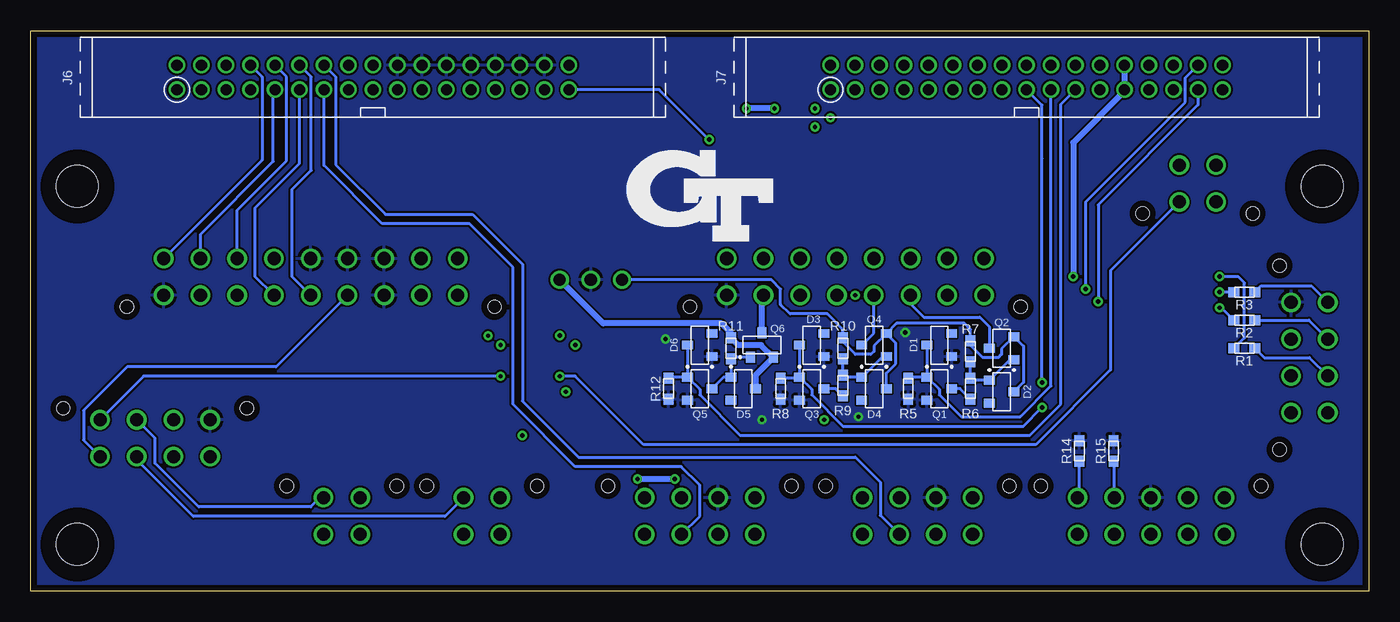
[diagram p6: board, bottom side, seen from below]

Size 109.22 x 45.72 mm. Coordinates in mm from the lower left corner, seen from the top.
Outline: 0,0 109.22,0 109.22,45.72 0,45.72 0,0
Copper layers (1+2*15+16): Top 0.035mm / dielectric 0.2mm / Route2 0.0175mm / dielectric 1.065mm / Route15 0.0175mm / dielectric 0.2mm / Bottom 0.035mm
Design rules "HyTech Default (4 Layer)": minimum track width 6mil, minimum drill 10mil, track to track 6mil, track to pad 6mil, pad to pad 6mil, via to via 20mil, smd to smd 6mil, copper to edge 20mil, drill to drill 21mil, minimum pad ring 8mil, minimum via ring 8mil, stop-mask expansion 3mil, vias tented up to drill 30mil, thermal gap 10mil

### Footprints (pad centres in the part's own frame; a part is rotated, then mirrored left to right if it is on the bottom)
OKI-78SR = drill 0.991: 1 -2.54,0; 2 0,0; 3 2.54,0
SOT-23 = smd 0.711 x 0.889: 1 -0.94,-1.003; 2 0.94,-1.003; 3 0,1.003
MOLEX_MICROFIT_PTH_VERTICAL_08_DUAL = drill 1.067: 1 4.496,-2.997; 2 1.499,-2.997; 3 -1.499,-2.997; 4 -4.496,-2.997; 5 4.496,0; 6 1.499,0; 7 -1.499,0; 8 -4.496,0 | hole 1.067: 7.493,0.94; -7.493,0.94
MOLEX_MICROFIT_PTH_VERTICAL_10_DUAL = drill 1.067: 1 5.994,-2.997; 2 2.997,-2.997; 3 0,-2.997; 4 -2.997,-2.997; 5 -5.994,-2.997; 6 5.994,0; 7 2.997,0; 8 0,0; 9 -2.997,0; 10 -5.994,0 | hole 1.067: 8.992,0.94; -8.992,0.94
MOLEX_MICROFIT_PTH_VERTICAL_04_DUAL = drill 1.067: 1 1.499,-2.997; 2 -1.499,-2.997; 3 1.499,0; 4 -1.499,0 | hole 1.067: 4.496,0.94; -4.496,0.94
EHT-117-01 = drill 0.9: 1 -16,-1; 2 -16,1; 3 -14,-1; 4 -14,1; 5 -12,-1; 6 -12,1; 7 -10,-1; 8 -10,1; 9 -8,-1; 10 -8,1; 11 -6,-1; 12 -6,1; 13 -4,-1; 14 -4,1; 15 -2,-1; 16 -2,1; 17 0,-1; 18 0,1; 19 2,-1; 20 2,1; 21 4,-1; 22 4,1; 23 6,-1; 24 6,1; 25 8,-1; 26 8,1; 27 10,-1; 28 10,1; 29 12,-1; 30 12,1; 31 14,-1; 32 14,1; 33 16,-1; 34 16,1
MOLEX_MICROFIT_PTH_VERTICAL_16_DUAL = drill 1.067: 1 10.5,-3; 2 7.5,-3; 3 4.5,-3; 4 1.5,-3; 5 -1.5,-3; 6 -4.5,-3; 7 -7.5,-3; 8 -10.5,-3; 9 10.5,0; 10 7.5,0; 11 4.5,0; 12 1.5,0; 13 -1.5,0; 14 -4.5,0; 15 -7.5,0; 16 -10.5,0 | hole 1.067: 13.5,0.94; -13.5,0.94
MOLEX_MICROFIT_PTH_VERTICAL_18_DUAL = drill 1.067: 1 12,-3; 2 9,-3; 3 6,-3; 4 3,-3; 5 0,-3; 6 -3,-3; 7 -6,-3; 8 -9,-3; 9 -12,-3; 10 12,0; 11 9,0; 12 6,0; 13 3,0; 14 0,0; 15 -3,0; 16 -6,0; 17 -9,0; 18 -12,0 | hole 1.067: 15,0.94; -15,0.94
0603-RES = smd 0.9 x 0.8: 1 -0.85,0; 2 0.85,0
5015 = smd 3.429 x 1.778: 1 0,0
MOUNTING_M3 = hole 3.4: 0,0
3588 = smd 1.575 x 2.819: 1 -4.953,3.035; 2 -4.953,-3.035; 3 4.953,-3.035; 4 4.953,3.035

### Placement (x,y rotation side)
A1  63.5,25.4 0 top
D1  35.05,20.07 90 bottom
D2  29.97,16.26 270 bottom
D3  45.47,20.07 90 bottom
D4  40.39,16.51 270 bottom
D5  51.05,16.51 270 bottom
D6  54.61,20.07 90 bottom
J1  6.35,19.05 270 top
J2  54.61,7.62 0 top
J3  36.83,7.62 0 top
J4  17.78,7.62 0 top
J5  13.97,31.75 180 top
J6  81.28,41.91 0 bottom
J7  27.94,41.91 0 bottom
J8  83.82,7.62 0 top
J9  72.39,7.62 0 top
J10  41.91,24.13 180 top
J11  86.36,24.13 180 top
J12  99.06,13.97 0 top
Q1  35.05,16.51 270 bottom
Q2  29.97,19.81 90 bottom
Q3  45.47,16.51 270 bottom
Q4  40.39,20.07 90 bottom
Q5  54.61,16.51 270 bottom
Q6  49.53,20.07 0 bottom
R1  10.16,19.81 180 bottom
R2  10.16,22.1 180 bottom
R3  10.16,24.38 180 bottom
R5  37.59,16.51 90 bottom
R6  32.51,16.51 90 bottom
R7  32.51,19.56 90 bottom
R8  48.01,16.51 90 bottom
R9  42.93,16.76 90 bottom
R10  42.93,19.81 90 bottom
R11  52.07,19.81 90 bottom
R12  57.15,16.51 90 bottom
R14  23.62,11.43 90 bottom
R15  20.83,11.43 90 bottom
TP1  29.46,32 90 top
TP2  33.27,32 90 top
TP3  37.08,32 90 top
TP4  40.89,32 90 top
TP5  44.7,32 90 top
TP6  48.51,32 90 top
U$4  [MOUNTING_M3]  3.81,33.02 0 top
U$5  [MOUNTING_M3]  3.81,3.81 0 top
U$6  [MOUNTING_M3]  105.41,3.81 0 top
U$7  [MOUNTING_M3]  105.41,33.02 0 top
U$11  [LOGO_GT_MEDIUM]  54.61,32.26 0 bottom
U$14  [LOGO_HYTECH_SMALL]  64.77,34.29 0 top
XF1  54.61,39.37 180 top

### Tracks (layer width: path | path; a pad name or v marks a point on that pad's centre or on a via)
!STEERING_2_CS
  Route15 0.254: J1.5 4.83,16.08 4.83,23.88 5.84,24.89 8.89,24.89 10.41,26.42 12.95,26.42 13.46,25.91 20.32,25.91 31.75,37.34 31.75,39.1 J7.15
+5V  (via drill 0.36)
  Top 0.254: J4.1 21.44,2.29 10.92,2.29 3.35,9.86 J1.1 4.8,16 17.53,16 20.32,18.8 20.32,33.27 22.35,35.31 46.99,35.31 48.01,34.29 51.31,34.29 v53.85,36.83
  Bottom 0.254: v53.85,36.83 57.93,40.91 J6.33
+12V
  Bottom 0.508: D5.3 50.05,17.6 Q6.2 49.59,20.07 51.47,20.07 R11.2 52.07,21.08 52.83,21.84 62.48,21.84 A1.3
+24V
  Top 0.254: J3.1 43.66,2.29 59.18,2.29 | J12.1 94.87,2.29 59.18,2.29 | J2.1 59.11,2.36 59.18,2.29
  Top 0.508: J6.34 60.07,42.91 XF1.2 XF1.1 59.56,26.8 A1.1 62.69,27.13 J11.1 J11.2 78.84,25.65 83.31,25.65 | J11.6 87.88,25.65 83.31,25.65 | J11.13 83.31,24.18 83.31,25.65
  Bottom 0.254: Q4.2 38.54,21.84 33.02,21.84 32.51,21.34 R7.2 32.51,20.07 31.5,19.05 30.23,19.05 29.97,19.3 29.97,19.75 Q2.2 28.19,19.98 28.19,17.03 D2.3 | Q4.2 40.39,20 40.39,19.56 40.64,19.3 41.91,19.3 42.93,20.32 R10.2 42.93,21.34 44.2,22.61 47.24,22.61 48.01,23.37 48.01,24.64 48.77,25.4 A1.1 | D4.3 39.38,17.78 38.61,18.55 38.61,20.23 Q4.2 | J11.13 89.2,18.29 101.35,18.29 104.9,14.73 104.9,12.32 J12.1
ACCEL_1_EXT
  Route15 0.254: J4.2 22.35,6.2 22.35,8.13 24.13,9.91 64.77,9.91 70.1,15.24 70.1,26.42 73.41,29.72 92.2,29.72 97.28,34.8 J6.1
ACCEL_2_EXT
  Route15 0.254: J6.2 96.27,41.9 96.27,34.8 91.95,30.48 73.15,30.48 69.34,26.67 69.34,15.49 64.52,10.67 21.84,10.67 19.3,8.13 19.3,6.15 J4.3
BMS_OK  (via drill 0.36)
  Top 0.254: v22.1,23.62 26.16,23.62 27.94,21.84 32.12,21.84 J10.10
  Bottom 0.254: J7.31 13.94,39.65 22.1,31.5 v22.1,23.62
BRAKE_1_EXT
  Route15 0.254: J4.4 16.26,6.1 16.26,8.13 19.56,11.43 64.26,11.43 68.58,15.75 68.58,26.92 72.9,31.24 91.69,31.24 95.28,34.83 J6.3
BRAKE_2_EXT
  Route15 0.254: J4.5 13.21,6.04 13.21,8.13 17.27,12.19 64.01,12.19 67.82,16 67.82,27.18 72.64,32 91.44,32 94.23,34.8 94.23,41.86 J6.4
BRAKE_PRESSURE_F_EXT
  Route2 0.254: J6.18 80.26,41.89 80.26,33.53 78.99,32.26 72.64,32.26 67.56,27.18 67.56,16 64.01,12.45 28.6,12.45 J4.6
  Bottom 0.254: J4.6 23.62,7.77 R14.1
BRAKE_PRESSURE_R_EXT
  Route2 0.254: J6.19 79.28,33.56 78.74,33.02 72.39,33.02 66.29,26.92 65.53,26.92 64.77,26.16 64.77,24.64 66.8,22.61 66.8,16.26 63.75,13.21 26.36,13.21 J4.7
  Bottom 0.254: J4.7 20.78,10.53 R15.1
BRAKELIGHT_12V
  Bottom 0.508: Q6.3 49.53,24.01 J10.15
BRAKELIGHT_EN
  Bottom 0.254: 55.63,17.45 Q5.1 54.61,16.45 54.61,16 51.31,12.7 27.69,12.7 25.15,15.24 25.15,39.7 J7.21 | 55.63,17.45 57.06,17.45 R12.2 | D6.3 55.63,20.05 55.63,17.45
CANH_1
  Top 0.254: J10.3 37.41,31.68 TP3.1
  Route15 0.254: J6.27 71.88,40.31 71.88,39.12 65.53,32.77 41.4,32.77 38.61,29.97 38.61,28.33 J10.3
CANH_2
  Top 0.254: TP1.1 31.41,30.06 J10.1
  Route15 0.254: J6.31 68.07,40.12 68.07,39.12 63.25,34.29 37.08,34.29 32.77,29.97 32.77,28.49 J10.1
CANH_3
  Top 0.254: J6.21 76.45,40.08 76.45,39.12 77.47,38.1 94.74,38.1 103.12,29.72 103.12,22.35 99.82,19.05 93.73,19.05 90.17,15.49 90.17,8.64 91.95,6.86 94.49,6.86 95.76,8.13 95.76,9.78 J12.4 | J10.6 46.41,29.9 TP6.1
  Route15 0.254: J10.6 45.21,28.33 45.21,29.72 46.23,30.73 66.55,30.73 71.12,35.31 72.9,35.31 76.45,38.86 76.45,40.08 J6.21
CANL_1
  Top 0.254: J10.4 40.41,31.52 TP4.1
  Route15 0.254: J10.4 39.12,28.42 39.12,29.72 41.66,32.26 65.79,32.26 72.39,38.86 72.39,40.02 J6.25
CANL_2
  Top 0.254: J10.2 33.27,28.27 TP2.1
  Route15 0.254: J10.2 33.27,28.27 33.27,29.72 37.34,33.78 63.5,33.78 68.58,38.86 68.58,40.21 J6.29
CANL_3
  Top 0.254: J6.23 75.95,40.24 75.95,38.86 77.22,37.59 94.49,37.59 102.62,29.46 102.62,22.61 99.57,19.56 93.47,19.56 89.66,15.75 89.66,8.38 91.69,6.35 94.74,6.35 96.27,7.87 96.27,9.68 J12.3 | J10.5 44.7,28.42 TP5.1
  Route15 0.254: J6.23 75.95,40.24 75.95,39.12 72.64,35.81 70.87,35.81 66.29,31.24 45.97,31.24 44.7,29.97 44.7,28.42 J10.5
CURRENT_EXT
  Route15 0.254: J6.6 92.23,41.86 92.23,34.83 90.93,33.53 72.02,33.53 66.13,27.64 52.92,27.64 J10.8
ECU_CLK  (via drill 0.36)
  Route15 0.254: v12.19,25.65 12.7,25.15 20.57,25.15 32.51,37.08 32.51,40.34 J7.13
  Bottom 0.254: R1.2 10.16,20.66 10.16,25.15 10.67,25.65 v12.19,25.65
ECU_SDI  (via drill 0.36)
  Route15 0.254: v12.19,23.11 12.7,23.62 21.08,23.62 34.04,36.58 34.04,39.01 J7.9
  Bottom 0.254: R2.2 12.03,23.11 v12.19,23.11
ECU_SDO  (via drill 0.36)
  Route15 0.254: J7.11 33.27,40.24 33.27,36.83 20.83,24.38 v12.19,24.38
  Bottom 0.254: R3.2 v12.19,24.38
GND  (via drill 0.36)
  other vias: 57.4,20.57 49.53,13.97 37.85,21.08 41.66,14.22
  pour Top: -1.27,46.99 -1.27,-1.27 110.49,-1.27 110.49,46.99
  pour Bottom: -2.54,48.26 -2.54,-2.54 111.76,-2.54 111.76,48.26
  pour Route15: -5.08,50.8 -5.08,-5.08 114.3,-5.08 114.3,50.8
  pour Route2: -3.81,49.53 -3.81,-3.81 113.03,-3.81 113.03,49.53
INVERTER_24V_EN
  Bottom 0.254: D1.3 Q1.1 | Q1.1 37.5,17.45 R5.2 | J7.19 25.94,16.73 28.45,14.22 33.27,14.22 35.05,16 35.05,16.45 Q1.1
INVERTER_24V_EN_BOOSTED
  Bottom 0.254: J10.11 37.41,23.44 36.32,22.35 31.75,22.35 30.98,21.58 Q2.3
INVERTER_EN  (via drill 0.36)
  Top 0.254: v26.67,14.99 v26.67,17.02
  Bottom 0.254: D3.3 Q3.1 | Q3.1 46.56,17.36 R8.2 | Q3.1 45.47,16.45 45.47,16 42.93,13.46 28.19,13.46 v26.67,14.99 | v26.67,17.02 26.67,35.31 26.67,39.64 J7.17
INVERTER_EN_BOOSTED
  Bottom 0.254: Q4.3 40.41,21.05 J10.12
LATCH_BTN  (via drill 0.36)
  Top 0.508: J10.14 44.89,25.65 v24.13,25.65
  Bottom 0.508: J7.26 J7.25 19.94,40.77 24.13,36.58 v24.13,25.65
LOAD_FL_EXT
  Bottom 0.254: J2.2 54.61,6.12 54.61,8.64 56.13,10.16 64.77,10.16 69.85,15.24 69.85,26.42 73.41,29.97 80.52,29.97 85.28,34.73 J6.13
LOAD_FR_EXT
  Bottom 0.254: J6.14 84.33,41.96 84.33,34.8 80.26,30.73 73.15,30.73 69.09,26.67 69.09,15.49 64.52,10.92 41.91,10.92 39.88,8.89 39.88,6.17 J3.2
LOAD_RL_EXT
  Bottom 0.254: J6.8 90.33,41.96 90.33,35.16 J11.9
LOAD_RR_EXT
  Bottom 0.254: J11.14 87.88,25.65 87.88,32.77 86.33,34.32 86.33,41.96 J6.12
N$1
  Bottom 0.254: R1.1 8.55,19.05 4.85,19.05 J1.2
N$2
  Bottom 0.254: R2.1 4.9,22.1 J1.3
N$3
  Bottom 0.254: R3.1 8.8,24.89 4.7,24.89 J1.4
N$5
  Bottom 0.254: Q2.1 29.3,18.87 D2.1 32.35,17.2 R6.2 R7.1
N$7
  Bottom 0.254: R6.1 33.36,16.51 Q1.3
N$8
  Bottom 0.254: Q4.1 39.71,19.13 D4.1 42.76,17.45 R9.2 R10.1
N$9
  Bottom 0.254: R9.1 43.52,16.51 Q3.3
N$11
  Bottom 0.254: Q6.1 51.97,19.06 R11.1 52.07,17.46 D5.1 52.67,17.45 Q5.3
OKHS_IN  (via drill 0.36)
  Top 0.254: J10.9 30.9,24.64 v23.11,24.64
  Bottom 0.254: J7.32 14.99,41.86 14.99,39.88 23.11,31.75 v23.11,24.64
REFERENCE_EXT
  Route15 0.254: J6.7 91.28,34.89 90.68,34.29 71.56,34.29 65.67,28.4 50.68,28.4 J10.7
SHDN_A
  Top 0.508: XF1.3 XF1.4 17.06,36.34 J5.2 J5.1
SHDN_B  (via drill 0.36)
  Top 0.254: v66.04,17.53 v70.87,17.53
  Top 0.508: J5.4 J5.3 10.41,33.81 10.41,39.38 J7.33 J7.34
  Bottom 0.254: J5.4 21.08,26.14 21.08,18.03 27.18,11.94 59.18,11.94 64.77,17.53 v66.04,17.53 | v70.87,17.53 100,17.53 J12.5
SHDN_G  (via drill 0.35)
  Top 0.508: J7.2 J7.1 46.99,40.91 48.51,39.38 v48.51,39.37 | v50.8,39.37 53.09,39.37 58.67,33.78 58.67,8.05 J2.5
  Bottom 0.508: v48.51,39.37 v50.8,39.37
SHDN_H  (via drill 0.36)
  Top 0.254: v41.91,24.13 41.91,17.2 J3.8
  Top 0.508: J2.6 54.59,6.1 33.86,6.1 J3.8
  Route2 0.254: J7.3 41.94,40.16 41.91,40.13 v41.91,24.13
SHDN_I  (via drill 0.35, 0.36)
  Top 0.254: v44.45,13.97 40.62,10.13 40.62,9.91
  Top 0.508: J3.6 40.62,9.91 55.88,9.91 v56.64,9.14 | v59.69,9.14 60.45,9.91 71.82,9.91 74.36,12.45 J11.10
  Route2 0.254: J7.4 42.93,41.92 42.93,29.97 44.96,27.94 44.96,14.48 v44.45,13.97
  Bottom 0.508: v59.69,9.14 v56.64,9.14
SHDN_J  (via drill 0.36)
  Top 0.254: v66.03,20.84 v71.87,20.84 v71.88,20.83
  Top 0.508: J11.11 79.14,22.35 90.58,22.35 J11.16
  Route2 0.254: v45.21,39.37 46.23,39.37 59.44,26.16 59.44,24.38 62.98,20.84 v66.03,20.84 | v71.88,20.83 74.06,20.83 J11.11
  Route15 0.254: J7.5 39.94,40.19 40.76,39.37 v45.21,39.37
SHDN_K  (via drill 0.36)
  Top 0.254: v64.77,20.07 v70.87,20.07
  Top 0.508: J11.17 93.58,22.35 92.06,22.35 86.87,17.16 86.87,6.1 85.39,4.62 J8.1 J8.2
  Route2 0.254: v43.94,38.61 45.97,38.61 58.67,25.91 58.67,24.13 62.74,20.07 v64.77,20.07 | v70.87,20.07 73.15,20.07 80.77,12.45 80.77,6.17 J8.2
  Route15 0.254: v43.94,38.61 40.39,38.61 38.89,40.1 38.89,41.86 J7.6
SHDN_L  (via drill 0.36)
  Top 0.254: v65.53,16.26 v69.09,12.7
  Top 0.508: J8.3 J8.4 79.32,4.62 J9.1 J9.2
  Route2 0.254: v45.21,37.85 45.72,37.85 57.91,25.65 57.91,23.88 v65.53,16.26 | v69.09,12.7 69.6,12.19 69.6,5.92 J9.2
  Route15 0.254: J7.7 37.94,39.78 39.88,37.85 v45.21,37.85
  Bottom 0.254: J8.3 85.6,7.62 86.36,6.86 95.5,6.86 99.06,10.41 99.06,12.47 J12.6
SHDN_M
  Top 0.508: J9.3 J9.4 69.37,6.1 58.42,6.1 57.66,6.86 57.66,18.77 53.82,22.61 44.93,22.61 J10.13
  Bottom 0.254: J9.3 75.41,6.1 95.94,6.1 100.56,10.72 J12.2
SPN_POT_1_EXT
  Route2 0.254: J6.15 83.28,33.5 79.76,29.97 73.41,29.97 69.85,26.42 69.85,15.24 64.77,10.16 56.13,10.16 54.61,8.64 54.61,6.12 J2.3
SPN_POT_2_EXT
  Route2 0.254: J6.16 82.3,41.93 82.3,33.53 79.5,30.73 73.15,30.73 69.09,26.67 69.09,15.49 64.52,10.92 54.1,10.92 51.82,8.64 51.82,6.33 J2.4
SPN_POT_3_EXT
  Route2 0.254: J6.17 81.28,33.53 79.25,31.5 72.9,31.5 68.33,26.92 68.33,15.75 64.26,11.68 39.88,11.68 36.83,8.64 36.83,6.12 J3.3
SPN_POT_4_EXT
  Bottom 0.254: J11.8 95.36,29.1 89.41,35.05 89.41,40.78 J6.9
SPN_POT_5_EXT
  Bottom 0.254: J11.7 92.36,31.08 88.33,35.12 88.33,41.96 J6.10
SPN_POT_6_EXT
  Bottom 0.254: J6.11 87.28,34.89 90.93,31.24 90.93,25.7 J11.15
STEERING_1_EXT
  Route15 0.254: J6.5 93.28,34.86 91.19,32.77 72.39,32.77 67.06,27.43 67.06,26.04 67.18,25.91 67.18,25.02 67.06,24.89 67.06,16.26 63.75,12.95 17.27,12.95 9.68,20.55 J1.7

### Text on the board
tPlace: BOTS | FIREWALL | Connector Board rev1 / Designed by Mikhail Allen | FIREWALL | STEERING | DASH | PEDALS | FR CORNER | FL CORNER | BRB | INERTIA